# EAGLE design EEZ DIB AUX PS r3B5 (EAGLE 7.2.0)
Assembly variants: Farnell, TME

## Sheet 1 of 2: Power board tester
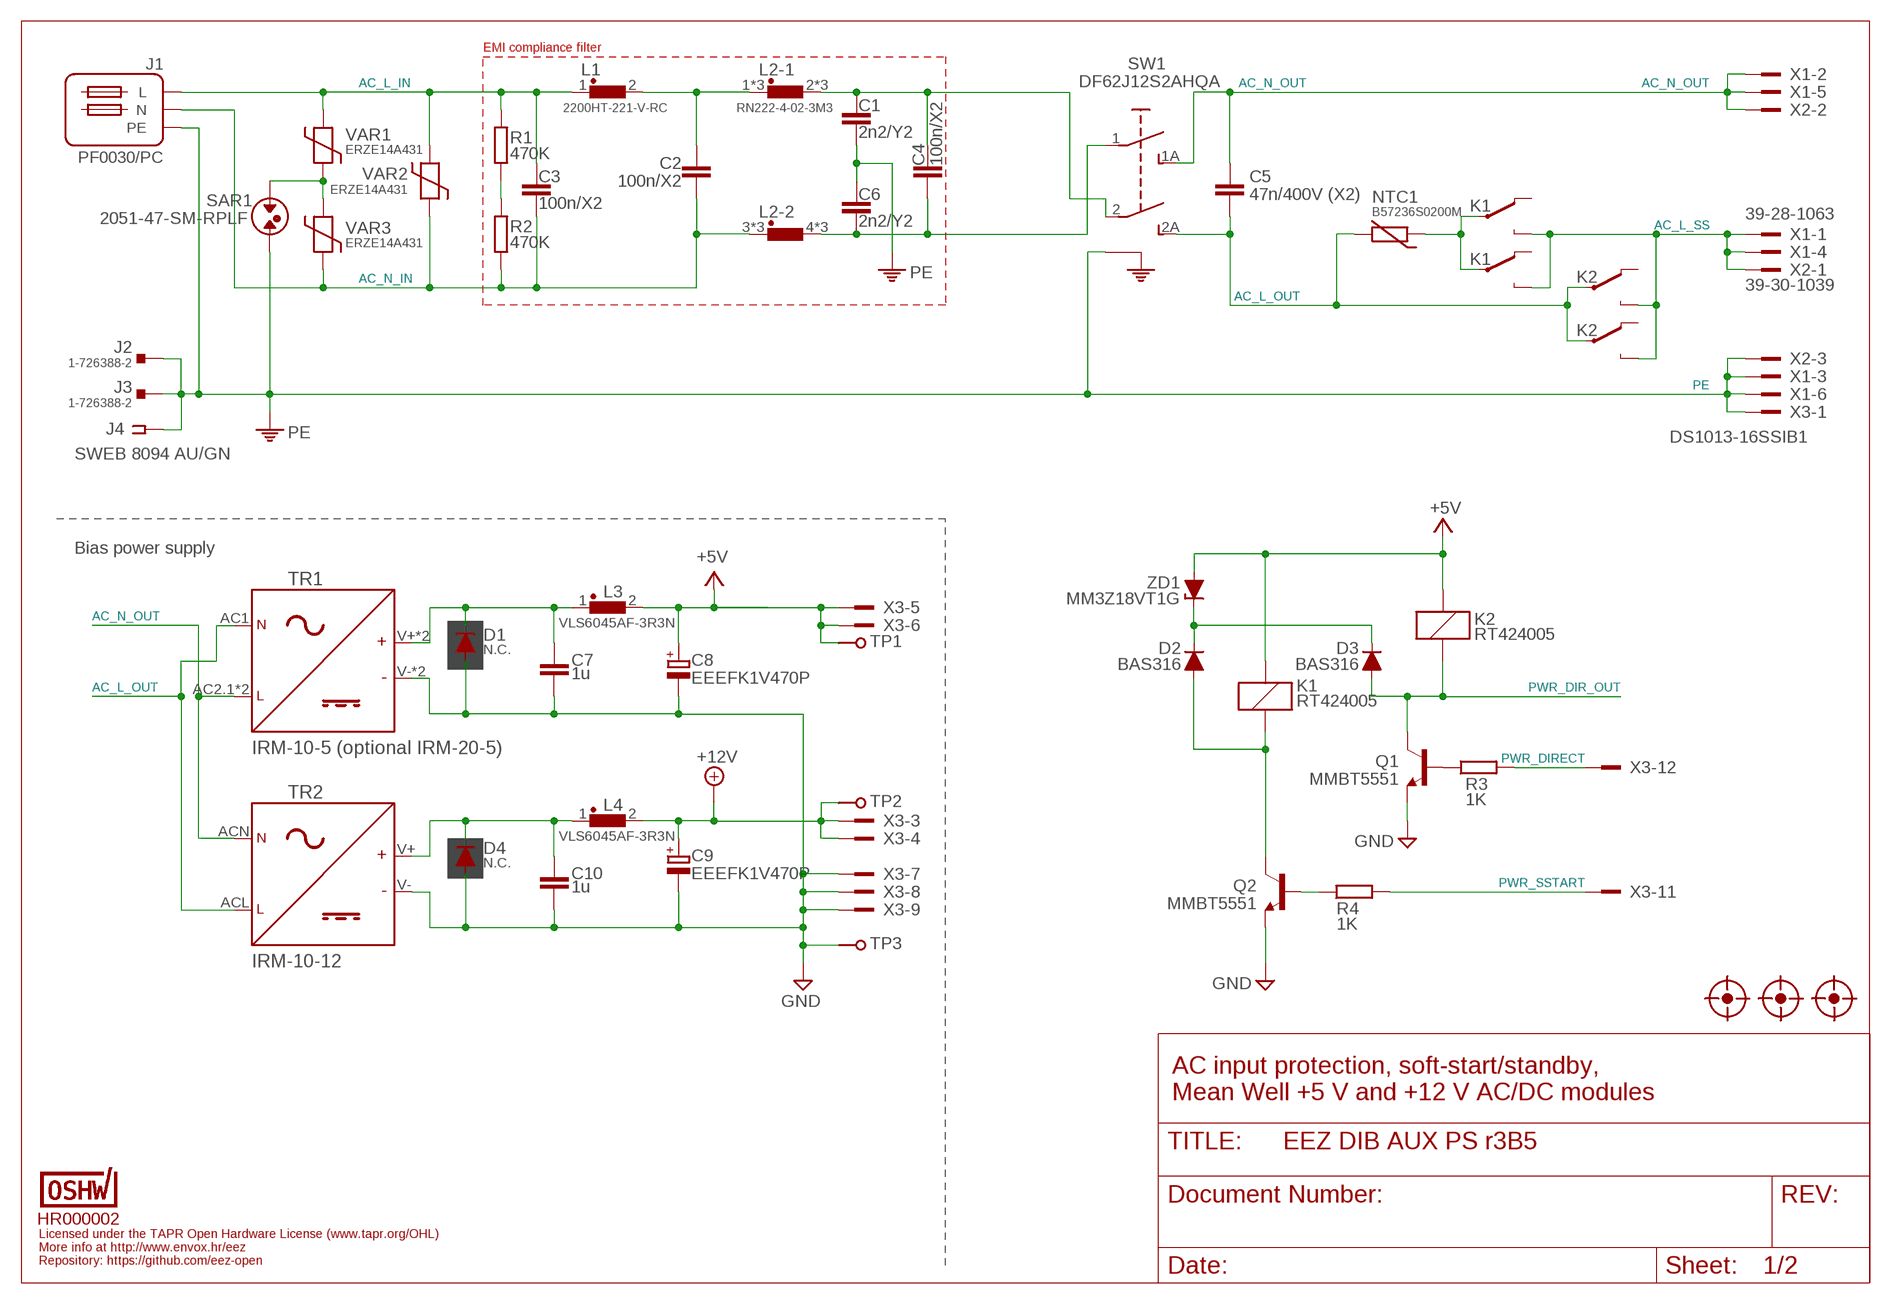
[diagram p0: schematic, sheet 1]

### Parts
C1  2n2/Y2  C-EU075-042X103  [C075-042X103]
C2  100n/X2  C-EU150-054X183  [C150-054X183]
C3  100n/X2  C-EU150-054X183  [C150-054X183]
C4  100n/X2  C-EU150-054X183  [C150-054X183]
C5  47n/400V (X2)  C-EU102-054X133  [C102-054X133]
C6  2n2/Y2  C-EU075-042X103  [C075-042X103]
C7  1u  C-EUC0805  [C0805]
C8  EEEFK1V470P  ECAPPANASONIC_H  [CAPAE660X610N]
C9  EEEFK1V470P  ECAPPANASONIC_H  [CAPAE660X610N]
C10  1u  C-EUC0805  [C0805]
D1  N.C.  DIODEDO214AA  [DO214AA]
D2  BAS316  DIODESOD323R  [SOD323-R]
D3  BAS316  DIODESOD323R  [SOD323-R]
D4  N.C.  DIODEDO214AA  [DO214AA]
FM1  FIDUCIAL  [FIDUCIAL]
FM2  FIDUCIAL  [FIDUCIAL]
FM3  FIDUCIAL  [FIDUCIAL]
J1  PF0030/PC  [PF0030/PC]
J2  1-726388-2  PCB_TAB4.8MM  [PCB_TAB-4.8MM]
J3  1-726388-2  PCB_TAB4.8MM  [PCB_TAB-4.8MM]
J4  SWEB 8094 AU/GN  BINDING_POSTCLIFF  [S16N-PC]
K1  RT424005  RELAY_RT314012-2  [RT-C/016A5_ROUND]
K2  RT424005  RELAY_RT314012-2  [RT-C/016A5_ROUND]
L1  2200HT-221-V-RC  BOURNS_2200  [BOURNS_2200]
L2  RN222-4-02-3M3  BOURNS_7100-COMBO  [BOURNS_7100_COMBO]
L3  VLS6045AF-3R3N  COILCRAFT_HPI0630  [COILCRAFT_HPI0630]
L4  VLS6045AF-3R3N  COILCRAFT_HPI0630  [COILCRAFT_HPI0630]
LABEL1  HR000002  OSHWA-CERT-SMALL  [CERT-SMALL-SILK]
NTC1  B57236S0200M  NTC11.5X6  [NTC_11.5X6_RM5]
Q1  MMBT5551  MMBT5551LT1-NPN-SOT23-BEC  [SOT23-BEC]
Q2  MMBT5551  MMBT5551LT1-NPN-SOT23-BEC  [SOT23-BEC]
R1  470K  R-EU_R1206  [R1206]
R2  470K  R-EU_R1206  [R1206]
R3  1K  R-EU_R0805  [R0805]
R4  1K  R-EU_R0805  [R0805]
SAR1  2051-47-SM-RPLF  SAR-SG  [SAR_4.5MM]
SW1  DF62J12S2AHQA  [DF62J12S2]
TP1  PCB_TEST_TABSHIELD  [PCB_SHIELD_TAB]
TP2  PCB_TEST_TABSHIELD  [PCB_SHIELD_TAB]
TP3  PCB_TEST_TABSHIELD  [PCB_SHIELD_TAB]
TR1  IRM-10-5 (optional IRM-20-5)  AC_DC_ADAPTERIRM10/20  [IRM-10/20_COMBO]
TR2  IRM-10-12  AC_DC_ADAPTERIRM10  [IRM-10]
VAR1  ERZE14A431  VARISTOR-16  [VARISTOR_16MM]
VAR2  ERZE14A431  VARISTOR-16  [VARISTOR_16MM]
VAR3  ERZE14A431  VARISTOR-16  [VARISTOR_16MM]
X1  39-28-1063  MINIFIT_5566-06A-CRE  [MINIFIT_5566-06A_CRE]
X2  39-30-1039  MINIFIT_39301039-CREEPAGE  [MINIFIT_39301039_CRE]
X3  DS1013-16SSIB1  IDC-16PIN  [IDC-16PIN]
ZD1  MM3Z18VT1G  ZENER-DIODESOD323R  [SOD323-R]

### Nets
+5V: C8.1(+) K1.A2(K:C1) K2.A1(K:C2) L3.2 TP1.1 X3.5 X3.6 ZD1.A ; also sheet 2
+12V: C9.1(+) L4.2 TP2.1 X3.3 X3.4 ; also sheet 2
AC_L_IN: C3.1 J1.L L1.1 R1.2 VAR1.2 VAR2.1
AC_L_OUT: C5.2 K2.11A(-1:P) K2.11B(-2:P) NTC1.1 SW1.2A(S1) TR1.AC1(AC/N) TR2.ACL(AC/L) ; also sheet 2
AC_L_RTC: C1.1 C4.2 L2.2 L2.2A L2.2B SW1.2(P1)
AC_L_SS: K1.14A(-1:O) K1.14B(-2:O) K2.14A(-1:O) K2.14B(-2:O) X1.1 X1.4 X2.1
AC_N_IN: C2.2 C3.2 J1.N L2.3 L2.3A L2.3B R2.1 VAR2.2 VAR3.1
AC_N_OUT: C5.1 SW1.1A(S) TR1.AC2.1(AC/L) TR1.AC2.2(AC/L) TR2.ACN(AC/N) X1.2 X1.5 X2.2 ; also sheet 2
AC_N_RTC: C4.1 C6.2 L2.4 L2.4A L2.4B SW1.1(P)
GND [gnd]: C7.2 C8.2(-) C9.2(-) C10.2 D1.A D4.A Q1.E Q2.E TP3.1 TR1.V-1(-) TR1.V-(-) TR2.V-(-) X3.7 X3.8 X3.9 ; also sheet 2
N$1: R1.1 R2.2
N$5: C2.1 L1.2 L2.1 L2.1A L2.1B
N$6: SAR1.1 VAR1.1 VAR3.2
N$7: K1.11A(-1:P) K1.11B(-2:P) NTC1.2
N$8: C10.1 D4.C L4.1 TR2.V+(+)
N$11: D2.C D3.C ZD1.C
N$12: Q2.B R4.1
N$15: C7.1 D1.C L3.1 TR1.V+1(+) TR1.V+(+)
N$16: D2.A K1.A1(K:C2) Q2.C
N$17: Q1.B R3.1
PE: C1.2 C6.1 J1.PE J2.1 J2.2 J3.1 J3.2 J4.1 J4.NC1 J4.NC2 J4.NC3 J4.NC4 SAR1.2 SW1.PE1(PE) SW1.PE2(PE) X1.3 X1.6 X2.3 X3.1
PWR_DIR_OUT: D3.A K2.A2(K:C1) Q1.C ; also sheet 2
PWR_DIRECT: R3.2 X3.12
PWR_SSTART: R4.2 X3.11
Unconnected: K1.12A(-1:S) K1.12B(-2:S) K2.12A(-1:S) K2.12B(-2:S) X3.10

### Notes on the sheet
- EMI compliance filter
- Bias power supply
- AC input protection, soft-start/standby,
  Mean Well +5 V and +12 V AC/DC modules
- Licensed under the TAPR Open Hardware License (www.tapr.org/OHL)
- More info at http://www.envox.hr/eez
- Repository: https://github.com/eez-open

## Sheet 2 of 2
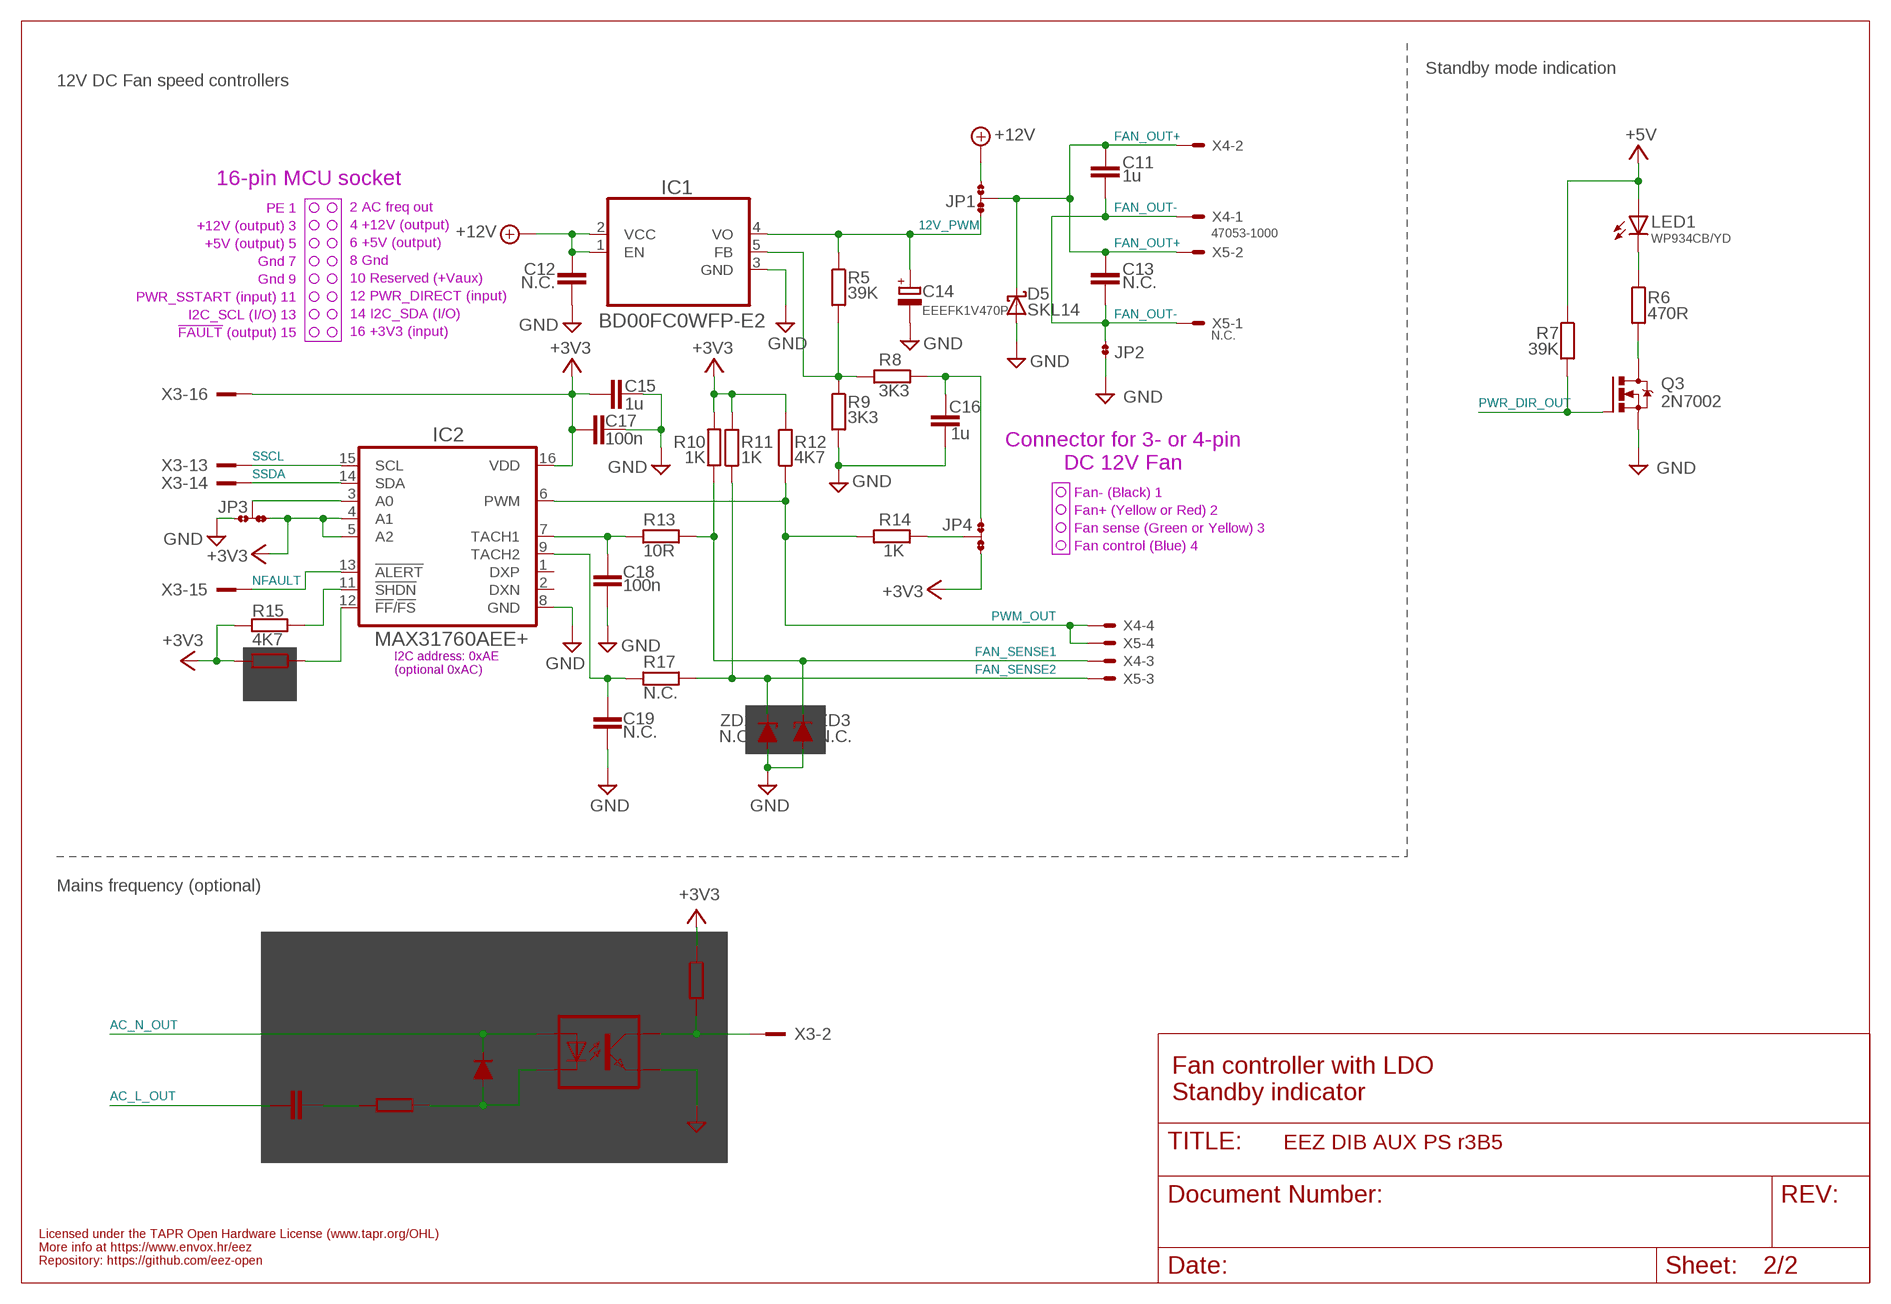
[diagram p1: schematic, sheet 2]

### Parts
C11  1u  C-EUC0805  [C0805]
C12  N.C.  C-EUC0805  [C0805]
C13  N.C.  C-EUC0805  [C0805]
C14  EEEFK1V470P  ECAPPANASONIC_H  [CAPAE660X610N]
C15  1u  C-EUC0805  [C0805]
C16  1u  C-EUC0805  [C0805]
C17  100n  C-EUC0603  [C0603]
C18  100n  C-EUC0603  [C0603]
C19  N.C.  C-EUC0603  [C0603]
C20  N.C.  C-EU102-054X133  [C102-054X133]
D5  SKL14  SCHOTTKYSOD123  [SOD123]
D6  N.C.  DIODESOD323R  [SOD323-R]
IC1  BD00FC0WFP-E2  BD00FC0W  [TO-252-5]
IC2  MAX31760AEE+  [DBQ16]
JP1  JP3-CUT-0805-ROTATED  [JP3-0805-CUT2]
JP2  JP2-NOCUT-0805  [JP2-0805-NOCUT]
JP3  JP3-CUT-0805-ROTATED  [JP3-0805-CUT2]
JP4  JP3-CUT-0805-ROTATED  [JP3-0805-CUT2]
LED1  WP934CB/YD  [WP934CB/YD]
OK1  N.C.  TLP291  [SO4]
Q3  2N7002  [SOT103P240X110-3N]
R5  39K  R-EU_R0805  [R0805]
R6  470R  R-EU_R0805  [R0805]
R7  39K  R-EU_R0805  [R0805]
R8  3K3  R-EU_R0805  [R0805]
R9  3K3  R-EU_R0805  [R0805]
R10  1K  R-EU_R0805  [R0805]
R11  1K  R-EU_R0805  [R0805]
R12  4K7  R-EU_R0805  [R0805]
R13  10R  R-EU_R0805  [R0805]
R14  1K  R-EU_R0805  [R0805]
R15  4K7  R-EU_R0805  [R0805]
R16  N.C.  R-EU_R0805  [R0805]
R17  N.C.  R-EU_R0805  [R0805]
R18  N.C.  R-EU_R0805  [R0805]
R19  N.C.  R-EU_R0805  [R0805]
X4  47053-1000  [47053-1000]
X5  N.C.  47053-1000  [47053-1000]
ZD2  N.C.  ZENER-DIODESOD123  [SOD123]
ZD3  N.C.  ZENER-DIODESOD123  [SOD123]

### Nets
12V_PWM: C14.1(+) IC1.4(VO) JP1.NC R5.1
+3V3: C15.2 C17.2 IC2.4(A1) IC2.5(A2) IC2.16(VDD) JP3.NC JP4.NO R10.2 R11.2 R12.2 R15.2 R16.2 R18.1 X3.16
+5V: LED1.A R7.1 ; also sheet 1
+12V: C12.1 IC1.1(EN) IC1.2(VCC) JP1.NO ; also sheet 1
AC_L_OUT: C20.1 ; also sheet 1
AC_N_OUT: D6.C OK1.1(A) ; also sheet 1
FAN_OUT+: C11.1 C13.1 D5.C JP1.COM X4.2 X5.2
FAN_OUT-: C11.2 C13.2 JP2.2 X4.1 X5.1
FAN_SENSE1: R10.1 R13.2 X4.3 ZD3.C
FAN_SENSE2: R11.1 R17.2 X5.3 ZD2.C
GND [gnd]: C12.2 C14.2(-) C15.1 C16.2 C17.1 C18.2 C19.2 D5.A IC1.3(GND) IC2.8(GND) JP2.1 JP3.NO OK1.3(EMIT) Q3.2(S) R9.2 ZD2.A ZD3.A ; also sheet 1
LDO_FB: IC1.5(FB) R5.2 R8.1 R9.1
N$2: C18.1 IC2.7(TACH1) R13.1
N$3: IC2.12(!FF!/!FS!) R16.1
N$4: JP4.COM R14.1
N$9: C16.1 JP4.NC R8.2
N$10: D6.A OK1.2(C) R19.2
N$13: Q3.3(D) R6.2
N$14: LED1.C R6.1
N$18: IC2.11(!SHDN) R15.1
N$19: OK1.4(COL) R18.2 X3.2
N$20: C20.2 R19.1
N$21: C19.1 IC2.9(TACH2) R17.1
N$23: IC2.3(A0) JP3.COM
NFAULT: IC2.13(!ALERT) X3.15
PWM_OUT: IC2.6(PWM) R12.1 R14.2 X4.4 X5.4
PWR_DIR_OUT: Q3.1(G) R7.2 ; also sheet 1
SSCL: IC2.15(SCL) X3.13
SSDA: IC2.14(SDA) X3.14
Unconnected: IC2.1(DXP) IC2.2(DXN)

### Notes on the sheet
- 12V DC Fan speed controllers | Standby mode indication
- 16-pin MCU socket
- PE 1
- 2 AC freq out
- +12V (output) 3
- 4 +12V (output)
- +5V (output) 5
- 6 +5V (output)
- Gnd 7
- 8 Gnd
- Gnd 9
- 10 Reserved (+Vaux)
- PWR_SSTART (input) 11
- 12 PWR_DIRECT (input)
- I2C_SCL (I/O) 13
- 14 I2C_SDA (I/O)
- !FAULT! (output) 15
- 16 +3V3 (input)
- Connector for 3- or 4-pin
  DC 12V Fan
- Fan- (Black) 1
- Fan+ (Yellow or Red) 2
- Fan sense (Green or Yellow) 3
- Fan control (Blue) 4
- I2C address: 0xAE
  (optional 0xAC)
- Mains frequency (optional)
- Fan controller with LDO
  Standby indicator
- Licensed under the TAPR Open Hardware License (www.tapr.org/OHL)
- More info at https://www.envox.hr/eez
- Repository: https://github.com/eez-open

## Library data of the parts
C1-C7 C10-C13 C15-C20 = rcl:C-EU: CAPACITOR, European symbol
C8 C9 C14 = EEZ_Lib1:ECAP
D1 D4 = MyLib6:DIODE
D2 D3 D6 = EEZ_Lib1:DIODE
D5 = EEZ_Lib1:SCHOTTKY
FM1-FM3 = EEZ_Lib1:FIDUCIAL: Fiducial mark for pick and place automation
IC1 = EEZ_DIB:BD00FC0W: Single-Output low saturation 1A LDO Regulator
IC2 = EEZ_DIB:MAX31760AEE+: Precision Fan-Speed Controller with Nonvolatile Lookup Table
J1 = EEZ_connectors:PF0030/PC: PC Flanged Mount Fused Inlet, twin fused 5 x 20 mm, 250 Vac, 10 A, PC spills
J2 J3 = EEZ_connectors:PCB_TAB: PCB quick-fit terminal
J4 = EEZ_Lib1:BINDING_POST: Various 4 mm binding posts
JP1 JP3 JP4 = EEZ_Lib1:JP3-CUT
JP2 = EEZ_Lib1:JP2-NOCUT
K1 K2 = EEZ_Lib1:RELAY_RT314012
L1 = EEZ_inductors_and_transformers:BOURNS_2200
L2 = EEZ_inductors_and_transformers:BOURNS_7100: Common Mode EMI Choke
L3 L4 = EEZ_inductors_and_transformers:COILCRAFT_HPI0630: High power inductor
LABEL1 = EEZ_Lib1:OSHWA-CERT
LED1 = EEZ_Lib1:WP934CB/YD: T-1 (3mm) Single-Level Circuit Board Indicator
NTC1 = EEZ_Lib1:NTC
OK1 = EEZ_Lib1:TLP291: Toshiba Photocopler GaAs IRED & Photo-transistor
Q1 Q2 = transistor:*-NPN-: NPN Transistror BF959 corrected 2008.03.06
Q3 = EEZ_Lib1:2N7002: N-CHANNEL ENHANCEMENT MODE FIELD EFFECT TRANSISTOR; MPN: 2N7002-7-F; OC_FARNELL: 1713823; OC_NEWARK: 25R5679; PACKAGE: SOT-23-3; SUPPLIER: DIODES INC.
R1-R19 = rcl:R-EU_: RESISTOR, European symbol
SAR1 = EEZ_Lib1:SAR: EPCOS surge arrester EF470X Farnell: 1886596
SW1 = EEZ_switches:DF62J12S2: Rocker switch SPST; Positions:2; OFF-ON; 16A/250VAC; 6A/48VDC
TP1-TP3 = EEZ_Lib1:PCB_TEST_TAB
TR1 TR2 = EEZ_Lib1:AC_DC_ADAPTER: MYRRA 47202 AC/DC PCB Mount Power Supply, Switch Mode, Fixed, 1 Output
VAR1-VAR3 = EEZ_Lib1:VARISTOR: EPCOS - B72220S0251K101 - VARISTOR, 140J, 250VAC Farnell: 1004357
X1 = EEZ_connectors:MINIFIT_5566-06A: Molex Socket; wire-board; male; Mini-Fit Jr; 4.2mm; PIN:6; THT; 9A; tinned
X2 = EEZ_connectors:MINIFIT_39301039: MOLEX socket; wire-board; male; Mini-Fit Jr; 4.2mm; PIN:3; THT; PCB snap
X3 = EEZ_connectors:IDC-16PIN: 16-pin IDC socket
X4 X5 = EEZ_connectors:47053-1000: KK 254 Vertical Header, with Friction Lock, 4 Circuits, PC Tail Length: 3.50mm
ZD1-ZD3 = EEZ_Lib1:ZENER-DIODE

## Net classes
0 default: width 0.152 mm, drill 0.3 mm, clearance 0.152 mm
1 diff: width 0.254 mm, drill 0.3 mm, clearance 0.254 mm
2 gnd: width 0.152 mm, drill 0.3 mm, clearance 0.152 mm

## Board
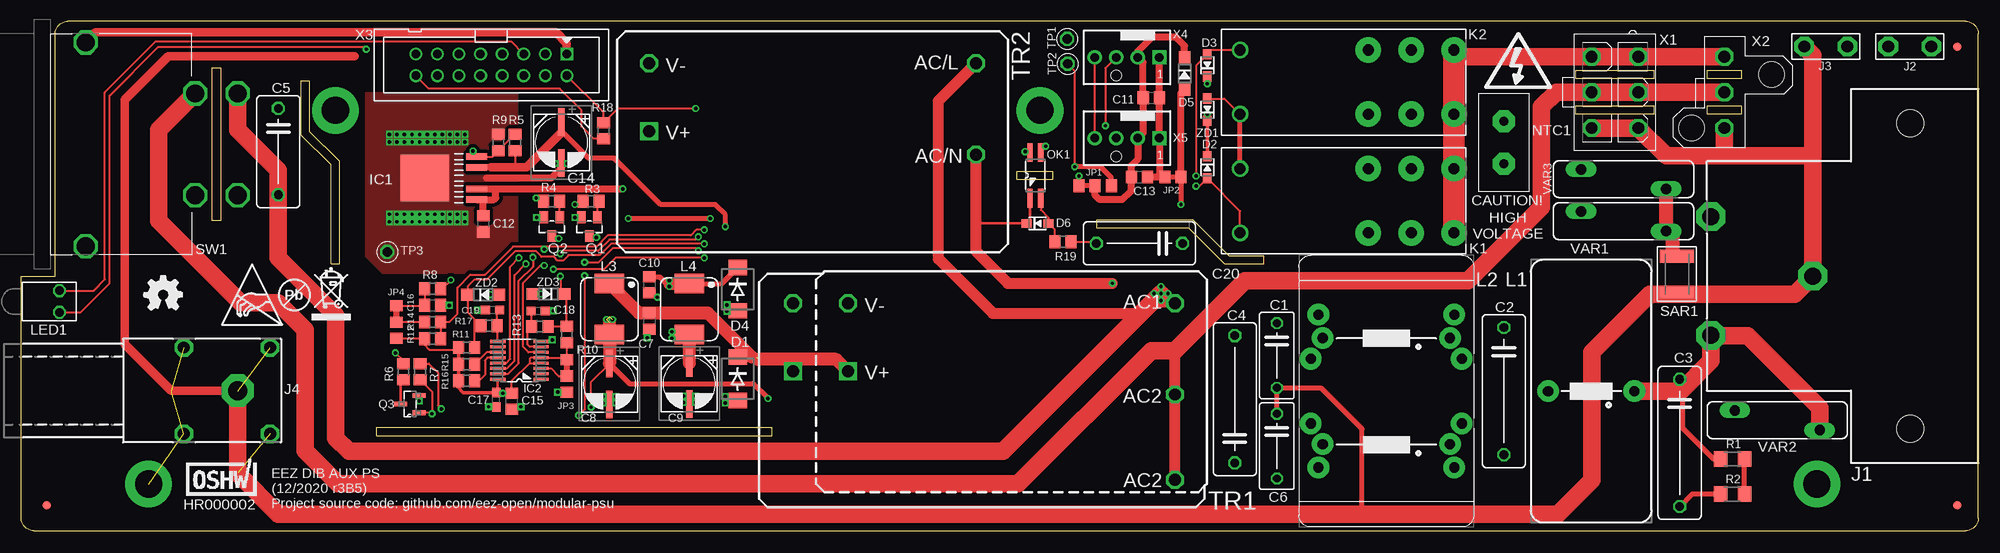
[diagram p2: board, top side]
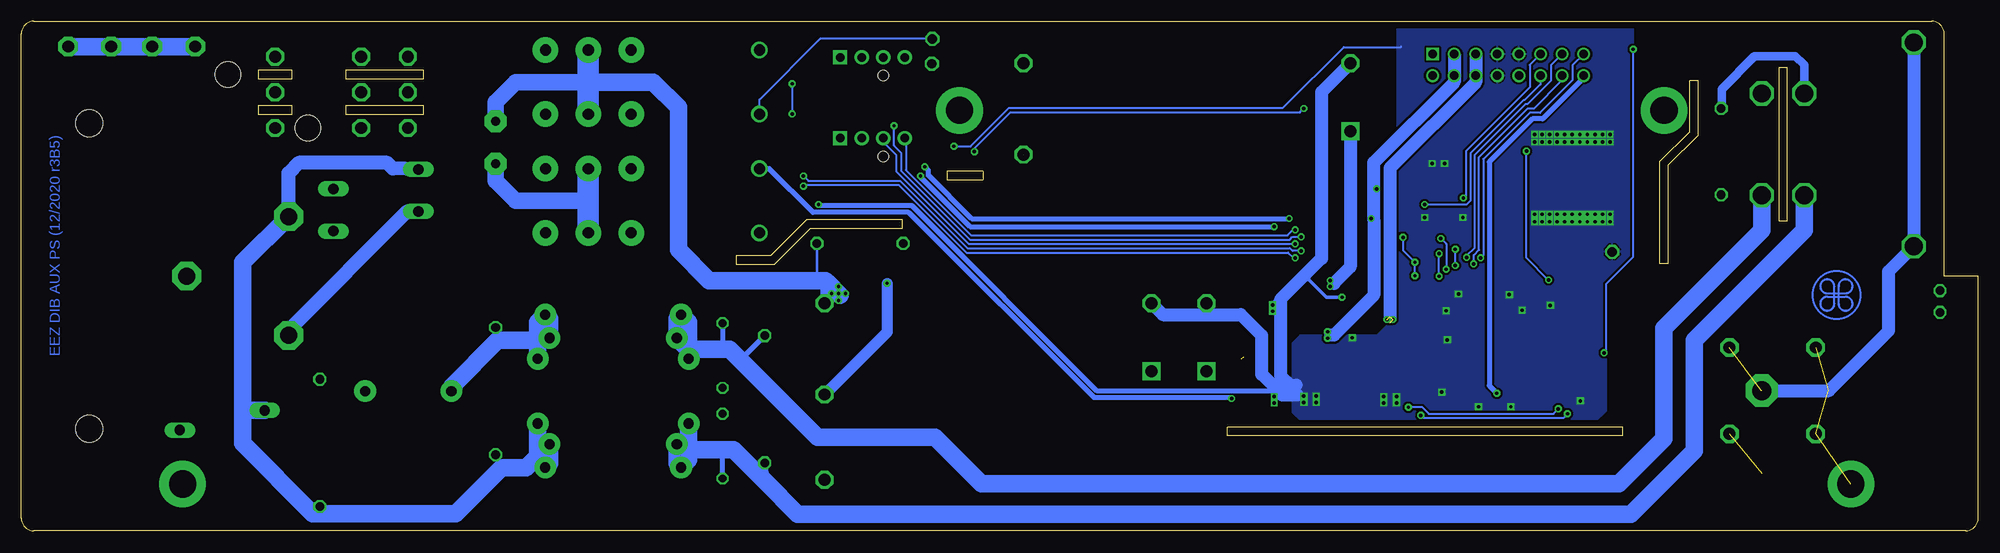
[diagram p3: board, bottom side, seen from below]

Size 230.5 x 60 mm. Coordinates in mm from the lower left corner, seen from the top.
Outline: 1.5,0 229,0 arc90 230.5,1.5 230.5,58.5 arc90 229,60 5.5,60 arc90 4,58.5 4,30 0,30 0,1.5 arc90 1.5,0
Outline: 33,46.6 33,53 34,53 34,47 37.5,43.5 37.5,31.42 36.5,31.42 36.5,43.1 33,46.6
Outline: 41.85,11.18 88.46,11.18 88.46,12.19 41.85,12.19 41.85,11.18
Outline: 126.68,36.64 137.99,36.64 142.24,32.38 146.3,32.38 146.3,31.37 141.8,31.37 137.54,35.62 126.68,35.62 126.68,36.64
Outline: 117.22,42.35 121.47,42.35 121.47,41.34 117.22,41.34 117.22,42.35
Copper layers (1*16): Top 0.035mm / dielectric 1.5mm / Bottom 0.035mm
Design rules "default *": minimum track width 6mil, minimum drill 0.3mm, track to track 4mil, track to pad 4mil, pad to pad 4mil, via to via 4mil, smd to smd 4mil, copper to edge 30mil, drill to drill 8mil, minimum pad ring 4mil, minimum via ring 8mil, stop-mask expansion 2.5mil, vias tented up to drill 0.6mm, thermal gap 8mil
vRestrict: area 167.3,39.9 to 169.9,41.1; area 167.4,53.8 to 170.1,55.1; area 167.4,50.5 to 170.1,51.8

### Footprints (pad centres in the part's own frame; a part is rotated, then mirrored left to right if it is on the bottom)
C075-042X103 = drill 0.914 octagon: 1 -3.81,0; 2 3.81,0
C150-054X183 = drill 1.016 octagon: 1 -7.493,0; 2 7.493,0
C102-054X133 = drill 1.016 octagon: 1 -5.08,0; 2 5.08,0
C0805 = smd 1.3 x 1.5: 1 -0.95,0; 2 0.95,0
CAPAE660X610N = smd 3.251 x 0.762: 1 -2.413,0; 2 2.413,0
C0603 = smd 1.1 x 1: 1 -0.85,0; 2 0.85,0
DO214AA = smd 1.8 x 2.2: A 2.55,0; C -2.55,0
SOD323-R = smd 1.2 x 1: A 1.3,0; C -1.3,0
SOD123 = smd 1.4 x 1.4: A 1.9,0; C -1.9,0
FIDUCIAL = smd 1.016 x 1.016: T 0,0
TO-252-5 = smd 0.762 x 2.489: 1 -2.54,-6.413; 2 -1.27,-6.413; 4 1.27,-6.413; 5 2.54,-6.413 | smd 5.5 x 5.7: 3 0,-0.32
DBQ16 = smd 1.803 x 0.356: 1 -2.553,2.223; 2 -2.553,1.587; 3 -2.553,0.953; 4 -2.553,0.318; 5 -2.553,-0.318; 6 -2.553,-0.953; 7 -2.553,-1.587; 8 -2.553,-2.223; 9 2.553,-2.223; 10 2.553,-1.587; 11 2.553,-0.953; 12 2.553,-0.318; 13 2.553,0.318; 14 2.553,0.953; 15 2.553,1.587; 16 2.553,2.223
PF0030/PC = drill 2 pad 3.4 octagon: L -7,31.5; N 7,31.5; PE 0,19.5 | hole 3.2: 18,8; -18,8
PCB_TAB-4.8MM = drill 1.4 pad 2.3 octagon: 1 -2.54,0; 2 2.54,0
S16N-PC = drill 2.2 pad 3.81 octagon: 1 0,0 | drill 1.4 pad 2.184 octagon: NC1 -3.8,5.08; NC2 -3.8,-5.08; NC3 6.36,5.08; NC4 6.36,-5.08
JP3-0805-CUT2 = smd 1.3 x 1.5: COM 0,0; NC 1.9,0; NO -1.9,0
JP2-0805-NOCUT = smd 1.3 x 1.5: 1 -0.95,0; 2 0.95,0
RT-C/016A5_ROUND = drill 1.3 pad 3: 11A 8.83,3.78; 11B 8.83,-3.78; 12A 3.79,3.78; 12B 3.79,-3.78; 14A 13.87,3.78; 14B 13.87,-3.78 | drill 1.3: A1 -11.33,-3.78; A2 -11.33,3.78
BOURNS_2200 = drill 1.2 pad 2.54: 1 -5.08,0; 2 5.08,0
BOURNS_7100_COMBO = drill 1.2 pad 2.54: 1 -8.89,-3.81; 1A -7.5,-6.25; 1B -8,-9; 2 8.89,-3.81; 2A 7.5,-6.25; 2B 8,-9; 3 -8.89,3.81; 3A -7.5,6.25; 3B -8,9; 4 8.89,3.81; 4A 7.5,6.25; 4B 8,9
COILCRAFT_HPI0630 = smd 2.3 x 3.5: 1 -3,0; 2 3,0
WP934CB/YD = drill 1 octagon: A 0,1.27; C 0,-1.27
NTC_11.5X6_RM5 = drill 1.1 pad 2.54 octagon: 1 -2.5,0; 2 2.5,0
SO4 = smd 0.6 x 2.2: 1 -0.635,-2.7; 2 0.635,-2.7; 3 0.635,2.7; 4 -0.635,2.7
SOT23-BEC = smd 1 x 1.4: B -0.95,-1.1; C 0,1.1; E 0.95,-1.1
SOT103P240X110-3N = smd 1.524 x 0.559: 1 -1.079,1.016; 2 -1.079,-1.016; 3 1.079,0
R1206 = smd 1.6 x 1.803: 1 -1.422,0; 2 1.422,0
R0805 = smd 1.3 x 1.5: 1 -0.95,0; 2 0.95,0
SAR_4.5MM = smd 1.5 x 4: 1 -2.1,0; 2 2.1,0
DF62J12S2 = drill 2.1 octagon: 1 17,-6; 1A 17,6; 2 22,-6; 2A 22,6; PE1 4.1,-12; PE2 4.1,12
PCB_SHIELD_TAB = drill 1.1 octagon: 1 0,0
IRM-10/20_COMBO = drill 1.4 octagon: AC1 3.75,3.75; AC2.1 3.75,14.5; AC2.2 3.75,24.55; V- 42.25,3.75; V-1 48.75,3.75 | drill 1.4 square: V+ 42.25,11.75; V+1 48.75,11.75
IRM-10 = drill 1.4 octagon: ACL 3.75,3.75; ACN 3.75,14.5; V- 42.25,3.75 | drill 1.4 square: V+ 42.25,11.75
VARISTOR_16MM = drill 1.2 long: 1 5,-1.15; 2 -5,1.15
MINIFIT_5566-06A_CRE = drill 1.4 octagon: 1 -4.2,2.75; 2 0,2.75; 3 4.2,2.75; 4 -4.2,-2.75; 5 0,-2.75; 6 4.2,-2.75
MINIFIT_39301039_CRE = drill 1.4 octagon: 1 0,4.2; 2 0,0; 3 0,-4.2 | hole 3: 5.55,2.1; -3.85,-4.2
IDC-16PIN = drill 1 pad 1.422 square: 1 -8.89,-1.27 | drill 1 pad 1.422: 2 -8.89,1.27; 3 -6.35,-1.27; 4 -6.35,1.27; 5 -3.81,-1.27; 6 -3.81,1.27; 7 -1.27,-1.27; 8 -1.27,1.27; 9 1.27,-1.27; 10 1.27,1.27; 11 3.81,-1.27; 12 3.81,1.27; 13 6.35,-1.27; 14 6.35,1.27; 15 8.89,-1.27; 16 8.89,1.27
47053-1000 = drill 1 pad 1.676 square: 1 3.81,0 | drill 1 pad 1.676: 2 1.27,0; 3 -1.27,0; 4 -3.81,0 | hole 1.25: -1.27,-2.16

### Placement (x,y rotation side)
C1  147.89,20.64 270 top
C2  174.62,16.45 270 top
C3  195.33,10.35 270 top
C4  142.94,15.49 90 top
C5  30.28,44.65 270 top
C6  147.89,9.97 270 top
C7  73.98,24.7 270 top
C8  69.28,17.27 270 top
C9  78.68,17.34 270 top
C10  73.98,28.96 270 top
C11  133.1,50.99 0 top
C12  54.42,36.13 270 top
C13  131.7,41.66 0 top
C14  63.63,45.72 270 top
C15  57.78,15.24 90 top
C16  48.45,26.54 0 top
C17  55.94,15.43 90 top
C18  60.9,25.91 0 top
C19  55.5,25.97 180 top
C20  131.7,33.85 180 top
D1  84.39,17.91 270 top
D2  139.7,42.8 270 top
D3  139.7,54.8 90 top
D4  84.39,28.45 270 top
D5  137.03,53.85 270 top
D6  119.7,36.2 0 top
EEZ_SIGNATURE  SIGNATURESMALL  [SIGNATURE_5MM]  16.71,27.76 180 top
FM1  228,3 0 top
FM2  3,3 0 top
FM3  228,57 0 top
IC1  47.24,41.53 90 top
IC2  58.67,20.07 180 top
J1  230.5,30 90 top
J2  222.44,57.02 180 top
J3  212.53,57.02 0 top
J4  25.5,16.5 180 top
JP1  126.49,40.64 180 top
JP2  135.64,41.66 180 top
JP3  64.26,18.22 90 top
JP4  44.2,24.57 90 top
K1  154.88,38.86 0 top
K2  154.88,52.83 0 top
L1  184.91,16.45 180 top
L2  160.78,16.45 180 top
L3  69.28,26.1 270 top
L4  78.68,26.1 270 top
LABEL1  23.56,4.13 0 top
LED1  4.5,27 0 top
NTC1  174.62,45.72 270 top
OK1  119.44,41.85 0 top
Q1  66.93,35.81 180 top
Q2  62.48,35.81 180 top
Q3  45.78,14.92 180 top
R1  201.55,8.45 180 top
R2  201.55,4.32 0 top
R3  67.12,38.8 180 top
R4  62.48,38.8 180 top
R5  58.17,45.72 90 top
R6  45.02,18.73 270 top
R7  46.99,18.73 270 top
R8  48.45,28.51 180 top
R9  56.2,45.72 90 top
R10  64.26,23.11 270 top
R11  52.45,21.59 180 top
R12  48.45,22.61 180 top
R13  61.09,24.07 0 top
R14  48.45,24.57 0 top
R15  52.45,19.62 180 top
R16  52.45,17.65 180 top
R17  55.12,24.13 180 top
R18  68.58,47.12 90 top
R19  122.68,34.04 180 top
SAR1  195.01,30.23 270 top
SW1  3.5,45.5 0 top
TP1  123.19,57.91 0 top
TP2  123.25,54.99 0 top
TP3  43.12,32.83 180 top
TR1  139.64,30.54 180 top
TR2  116.2,58.8 180 top
U$2  [PB_SMALL]  32.16,27.78 180 top
U$3  [RECYCLE_BIN1/8]  34.2,24.8 0 top
U$4  [ESD_SYMBOL]  23.62,24.27 0 top
VAR1  188.72,36.45 0 top
VAR2  206.82,13.02 0 top
VAR3  188.72,41.4 180 top
X1  187.71,51.63 270 top
X2  200.6,51.63 0 top
X3  55.37,54.86 180 top
X4  130.24,55.75 0 top
X5  130.24,46.23 0 top
ZD1  139.7,49.59 90 top
ZD2  54.42,27.81 0 top
ZD3  62.1,27.88 180 top

### Tracks (layer width: path | path; a pad name or v marks a point on that pad's centre or on a via)
12V_PWM  (via drill 0.4)
  Top 0.254: 58.17,42.74 58.23,42.8 | R5.1 58.17,42.86 58.1,42.8
  Top 0.406: 63.5,46.8 63.5,48.01 C14.1
  Top 0.61: JP1.NC v124.59,41.78 | v82.93,35.81 82.93,37.21 81.72,38.42 75.31,38.42 69.85,43.88 66.8,43.88 63.88,46.8 63.5,46.8
  Top 0.711: 55.37,42.8 IC1.4
  Top 1.016: 55.37,42.8 58.1,42.8 58.23,42.8 59.5,42.8 63.5,46.8
  Bottom 0.61: v82.93,35.81 118.75,35.81 124.59,41.66 v124.59,41.78
+3V3  (via drill 0.4)
  Top 0.254: 55.77,17.84 IC2.16 55.69,17.84 55.44,17.78 | C15.2 57.78,17.65 59.88,19.75 | 59.88,19.75 IC2.4 | 59.88,19.75 59.88,20.26 60.01,20.38 IC2.5 64,20.38 JP3.NC R10.2 | R11.2 51.25,21.34 48.07,21.34 47.5,21.91 R12.2 47.43,22.67 JP4.NO | R18.1 67.43,46.17 65.98,47.62 65.98,49.53 63.44,52.07 48.01,52.07 X3.16
  Top 0.305: 56.07,17.79 IC2.16 56.12,16.28 C17.2
  Top 0.406: R11.2 R15.2 R16.2 51.44,17.59 51.44,16.89 52.05,16.28 C17.2
  Top 0.61: 57.91,15.94 C15.2 v56.71,16.19 56.71,16.28 56.12,16.28
  Bottom 0.61: v56.71,16.19 57.59,17.08 57.59,43.43 52.51,48.51 51.31,48.51 46.48,53.34 X3.16
+5V  (via drill 0.4)  (3 unrouted)
  Top 0.254: LED1.A 8.52,28.27 9.84,29.59 9.84,51.63 15.85,57.63 57.68,57.63 X3.5 | R7.1 48.01,19.68 49.09,18.61 49.09,14.73 v49.47,14.35 | ZD1.A 141.71,50.89 K2.A1 | v67.12,14.54 67.12,17.53 C8.1
  Top 0.406: C8.1 69.28,19.3
  Top 0.61: 69.69,19.68 C8.1 71.63,17.34 86.19,17.34 v87.95,15.58 | K1.A2 K2.A1
  Top 1.524: C8.1 L3.2 69.29,24.5
  Bottom 0.254: v49.47,14.35 50.04,13.78 64.71,13.78 65.47,14.54 v67.12,14.54 | TP1.1 136.4,57.91 143.55,50.76 K2.A1
  Bottom 0.61: K1.A2 142.4,42.64 137.26,37.5 125.98,37.5 104.18,15.7 88.06,15.7 v87.95,15.58
  Bottom 1.524: X3.5 X3.6 59.18,52.83 69.28,42.74 69.28,25.21
  other vias: 68.95,24.88 69.64,24.88
+12V  (via drill 0.4)
  Top 0.254: TP2.1 124.08,54.17 v124.08,42.86 | L4.2 76.98,23.1 | 76.98,23.1 v76.64,23.43 | 76.98,23.1 76.64,22.77 v76.64,22.67
  Top 0.61: C9.1 78.68,19.05 | v81.15,36.77 v71.5,36.77 | v124.08,42.86 127.13,42.86 128.39,41.6 JP1.NO
  Top 0.813: IC1.2 55.75,40.26 | 55.75,40.26 v70.87,40.26 | IC1.1 54.36,38.99 | 54.36,38.99 55.69,38.99 55.88,39.18 55.88,40.13 55.75,40.26 | C12.1 54.42,38.92 54.36,38.99
  Top 1.524: L4.2 C9.1
  Bottom 0.254: 76.26,23.05 v76.64,22.67
  Bottom 0.61: v81.15,36.77 118.56,36.77 123.7,41.91 123.7,42.48 v124.08,42.86 | v71.5,36.77 71.31,36.77 71.18,36.64
  Bottom 0.813: v70.87,40.26 71.12,40.26 71.18,40.32
  Bottom 1.524: X3.3 X3.4 61.72,52.83 71.18,43.37 71.18,40.32 71.18,36.64 71.18,27.75 75.88,23.05 76.26,23.05
AC_L_IN
  Top 0.508: C3.1 195.33,16.57 195.45,16.45
  Top 0.61: R1.2 199.33,8.45 195.71,12.06 195.71,16.19 195.45,16.45
  Top 2.032: L1.1 195.45,16.45 199,19.99 J1.L 199.01,22.99 203.33,22.99 211.82,14.49 VAR2.1
  Bottom 1.676: J1.L 199,23.63 185.03,37.6 VAR1.2
AC_L_OUT  (via drill 0.4)
  Top 0.254: 108.08,47.5 108.01,47.43 | 108.2,39.81 108.01,39.81
  Top 1.016: TR1.AC1 133.92,26.79
  Top 1.27: TR2.ACL 108.01,50.61 108.01,47.43 108.01,39.81 108.01,32 114.43,25.59 131.89,25.59
  Top 2.032: SW1.2A 25.5,47.21 30.28,42.43 C5.2 30.28,32.14 37.02,25.4 37.02,10.92 38.6,9.34 115.64,9.34 131.89,25.59 134.21,27.91
  Bottom 0.254: 134.05,27.75 v134.24,27.94
  Bottom 0.305: C20.1 136.78,29.84 137.16,29.46
  Bottom 1.016: TR1.AC1 135.89,28.77 135.48,29.18
  Bottom 1.93: NTC1.1 174.62,50.48 172.28,52.83 164.21,52.83
  Bottom 2.032: 164.21,52.83 163.71,52.83 156.08,52.83 153.1,49.85 153.1,33.08 149.48,29.46 137.16,29.46 135.76,29.46 135.48,29.18 134.05,27.75
  Bottom 2.54: K2.11A 163.71,52.83 K2.11B
  other vias: 134.24,28.77 135.06,27.94 134.24,27.11 133.41,27.94
  pour Top (no thermals): 132.19,27.15 134.09,29.04 134.37,29.04 135.34,28.07 135.34,27.79 133.45,25.9
AC_L_RTC
  Bottom 0.61: C1.1 147.89,21.56 148.08,21.37 | 145.67,19.94 145.67,20.26 C4.2
  Bottom 2.032: SW1.2 25.5,35.4 37.02,23.88 37.02,10.86 42.35,5.52 117.41,5.52 122.87,10.99 136.72,10.99 145.67,19.94 147.1,21.37 148.08,21.37 151.95,21.37 L2.2A 153.28,24.95 L2.2B 151.89,24.56 L2.2
AC_L_SS
  Top 2.032: X2.1 X1.1 X1.4 169.53,55.83 K2.14A
  Top 2.54: K2.14A K2.14B K1.14A K1.14B
AC_N_IN
  Top 0.61: R2.1 196.79,4.32 C3.2
  Bottom 0.203: C3.2 195.33,2.22 195.52,2.03
  Bottom 0.61: 173.93,7.43 174.18,7.68 C2.2
  Bottom 1.676: VAR3.1 186.75,42.67 187.39,43.31 197.8,43.31 199,42.11 J1.N
  Bottom 2.032: L2.3 169.67,8.34 169.46,8.13 | 169.46,8.13 L2.3B 168.28,7.95 L2.3A 171.05,7.43 173.93,7.43 179.32,2.03 195.52,2.03 196.15,2.03 204.41,10.29 204.41,14.03 | 169.46,8.95 169.46,8.13 | J1.N 204.41,31.59 204.41,14.03 | VAR2.2 204.27,14.17 204.41,14.03
AC_N_OUT  (via drill 0.4)  (1 unrouted)
  Top 0.305: OK1.1 118.81,36.61 D6.C 112.58,36.2 112.46,36.32
  Top 1.27: TR2.ACN 112.46,36.32 112.46,32.89 116.2,29.15 v128.52,29.15 | 135.89,21.21 TR1.AC2.1 TR1.AC2.2
  Top 2.032: X2.2 X1.2 X1.5 180.78,51.63 179.07,49.91 179.07,38.12 170.41,29.46 144.15,29.46 135.89,21.21 133.09,21.21 117.41,5.52 37.34,5.52 33.47,9.4 33.47,23.69 30.28,26.87 25.84,26.87 16.19,36.51 16.19,47.19 SW1.1A
  Bottom 1.016: SW1.1A 20.5,54.85 21.53,55.88 26.35,55.88 30.23,52.01 30.23,49.78 C5.1
  Bottom 1.27: v128.52,29.15 128.52,23.41 TR1.AC2.1
AC_N_RTC
  Bottom 0.254: C4.1 142.57,8
  Bottom 0.61: C6.2 147.89,9.4 148.02,9.53 | C4.1 142.69,5.81 142.91,5.81
  Bottom 2.032: SW1.1 20.5,35.38 33.47,22.42 33.47,9.4 40.89,1.97 139.06,1.97 142.91,5.81 146.62,9.53 148.02,9.53 152.61,9.53 L2.4A 153.28,7.95 L2.4B 152.41,7.82 | L2.4 151.89,8.34 152.41,7.82 | 152.4,7.81 152.41,7.82
FAN_OUT+
  Top 0.813: D5.C 137.03,57.09 136.02,58.1 133.16,58.1 131.51,56.45 X4.2 132.15,55.12 C11.1 132.15,46.87 X5.2 131.51,43.75 130.75,42.99 C13.1 130.75,40.07 129.67,38.99 127,38.99 126.49,39.5 JP1.COM
FAN_OUT-
  Top 0.813: C13.2 134.18,41.66 | X4.1 C11.2 X5.1 134.05,41.78 134.18,41.66 | JP2.2 134.18,41.66
FAN_SENSE1  (via drill 0.4)
  Top 0.254: 64.52,27.82 ZD3.C | R13.2 R10.1 64.26,27.82 ZD3.C | 64.33,28.2 ZD3.C | v79.76,34.61 79.44,34.29 69.28,34.29 67.94,32.96 63.82,32.96 v63.5,32.64 | v63.5,29.97 63.5,28.38 ZD3.C | X4.3 127.7,54.48 v127.7,47.69
  Bottom 0.254: v79.76,34.61 80.77,34.61 81.09,34.29 118.77,34.29 126.87,42.39 126.87,44.51 127.7,45.34 v127.7,47.69 | v63.5,29.97 v63.5,32.64
FAN_SENSE2  (via drill 0.4)
  Top 0.254: 52.64,27.69 52.64,25.66 53.4,24.9 53.4,24.19 | 52.64,27.69 ZD2.C | R11.1 53.4,24.19 | R17.2 53.47,24.13 53.4,24.19 | 52.64,27.69 52.64,28.83 53.4,29.59 54.86,29.59 58.23,32.96 60.58,32.96 61.28,32.26 62.74,32.26 63.18,31.81 63.82,31.81 64.45,32.45 68.14,32.45 69.47,33.78 v80.45,33.78
  Bottom 0.254: v80.45,33.78 118.91,33.78 127.44,42.32 127.44,44.26 128.97,45.78 X5.3
GND  (via drill 0.4)
  Top 0.254: ZD3.A v61.21,27.88 | C18.2 v62.67,25.91 | ZD2.A v55.24,27.81 | IC2.8 62.36,22.29 v62.55,22.48 | C9.2 78.11,14.99 v77.98,15.11 | v68.52,15.05 69.09,15.05 C8.2 | v50.42,26.54 C16.2 | OK1.3 120.08,45.28 v120.65,45.28 | C7.2 73.72,23.5 v73.72,22.73 | C10.2 v74.93,27.5 | Q2.E 60.73,36.91 v60.71,36.89 | Q1.E 65.23,36.91 v65.22,36.89
  Top 0.305: v53.72,25.97 C19.2 | Q3.2 v46.86,15.3 | v63.18,16.32 JP3.NO | v58.86,14.61 C15.1
  Top 0.61: C17.1 v55.05,14.61 | JP2.1 v136.59,38.42 | D1.A 83.24,15.36 v82.93,15.05 | D4.A 83.17,25.9 v83.12,25.84
  Top 0.813: 54.8,41.53 62.42,41.53 63.63,42.74 C14.2 | JP2.1 136.59,49.34 136.59,51.5 D5.A
  Bottom 0.254: 77.66,48.9 77.34,48.58 | v120.65,45.28 118.68,45.28 114.17,49.78 81.92,49.78 74.74,56.96 68.01,56.96 67.94,57.02
  Bottom 0.406: v74.93,27.5 76.77,27.5 79.34,30.07
  Bottom 0.61: v136.59,38.42 136.49,38.32 125.64,38.32 103.83,16.51 81.99,16.51 81.48,16 | 81.98,16 82.74,16 v82.93,15.81 v82.93,15.05 | 82.17,27.24 82.49,27.24 v83.12,26.61 v83.12,25.84
  Bottom 0.813: 80.96,15.75 80.71,16
  Bottom 1.524: TR2.V- 77.34,51.66 77.34,48.58 77.34,32.07 79.34,30.07 82.17,27.24 82.17,18.22 81.09,17.14 80.33,17.14 | 80.2,16 80.71,16 81.48,16 81.98,16 84.39,18.41 84.39,22.99 86.87,25.46 90.93,25.46 | 90.93,25.46 96.06,25.46 TR1.V- | TR1.V-1 90.89,25.51 90.93,25.46
  other vias: 47.82,37.27 46.93,37.27 46.04,37.27 45.15,37.27 44.26,37.27 43.37,37.27 48.7,37.27 49.59,37.27 50.48,37.27 51.37,37.27 52.26,37.27 43.37,45.78 44.26,45.78 45.15,45.78 46.04,45.78 46.93,45.78 47.82,45.78 48.7,45.78 49.59,45.78 50.48,45.78 51.37,45.78 52.26,45.78 43.37,46.67 44.26,46.67 45.15,46.67 46.04,46.67 46.93,46.67 47.82,46.67 48.7,46.67 49.59,46.67 50.48,46.67 51.37,46.67 52.26,46.67 43.37,36.39 44.26,36.39 45.15,36.39 46.04,36.39 46.93,36.39 47.82,36.39 48.7,36.39 49.59,36.39 50.48,36.39 51.37,36.39 52.26,36.39 77.98,15.88 79.44,15.88 79.44,15.11 70.04,15.81 70.04,15.05 68.52,15.81 64.33,43.24 62.87,43.24
  pour Bottom (isolate 0.254): 79.63,12.83 45.15,12.83 43.81,14.16 43.81,29.08 40.64,32.26 40.64,60.64 68.45,60.64 68.45,25.34 70.8,22.99 79.88,22.99 80.77,22.1 80.77,13.97
  pour Top (isolate 0.406, no thermals): 42.55,30.35 40.64,32.26 40.64,51.56 58.42,51.56 58.42,30.35
HOLE_UL  (via drill 3.2 pad 5.5)
  other vias: 37,49.5
HOLE_UM  (via drill 3.2 pad 5.5)
  other vias: 120,49.5
HOLE_UR  (via drill 3.2 pad 5.5)
  other vias: 211.5,5.5
LDO_FB  (via drill 0.4)
  Top 0.254: 53.59,43.94 IC1.5 | R5.2 58.1,46.67 R9.1 55.5,44.07 IC1.5 | 49.4,28.64 R8.1 49.59,28.51 v50.61,29.53 | v53.21,44.7 53.21,44.51 IC1.5
  Bottom 0.254: v53.21,44.7 53.21,32.13 v50.61,29.53
N$1
  Top 0.61: R2.2 R1.1
N$2
  Top 0.254: IC2.7 59.88,21.65 59.63,21.91 59.63,23.56 R13.1 60.05,24.16 C18.1
N$3
  Top 0.254: IC2.12 54.93,20.38 54.61,20.07 54.61,18.35 53.91,17.65 R16.1
N$4
  Top 0.254: R14.1 JP4.COM
N$5
  Bottom 0.61: C2.1 174.24,23.88 174.24,22.42 | 169.46,23.94 170.37,23.03 170.37,22.42
  Bottom 2.032: L2.1A 168.28,24.95 L2.1B 169.67,24.56 169.67,24.15 | L2.1 169.67,24.15 | 169.67,24.15 169.46,23.94 | 170.37,22.42 174.24,22.42 174.37,22.42 179.83,16.95 L1.2
N$6
  Top 0.254: SAR1.1 194.92,32.33 194.48,32.77
  Top 1.676: VAR3.2 VAR1.1 194.49,35.31 194.48,32.77 194.48,32.53
N$7
  Bottom 1.93: 163.71,38.86 172.28,38.86 174.62,41.21 NTC1.2
  Bottom 2.54: K1.11A 163.71,38.86 K1.11B
N$8  (via drill 0.4)
  Top 0.254: v76.33,28.77 76.33,29.05 76.38,29.1
  Top 0.61: C10.1 75.19,29.91 v76.33,28.77 | 78.69,29.08 82.48,29.08 D4.C
  Top 1.524: 78.69,29.08 L4.1 76.38,29.1
  Bottom 0.254: v76.33,29.46 v76.33,28.77 75.95,29.15 75.88,29.15
  Bottom 1.524: TR2.V+ 73.95,31.07 75.88,29.15
N$9
  Top 0.254: R8.2 C16.1 47.43,26.47 JP4.NC
N$10
  Top 0.254: OK1.2 120.08,37.78 121,36.86 D6.A 121.73,35.46 R19.2
N$11  (via drill 0.4)
  Top 0.254: D3.C v139.7,52.64 | v139.7,49.09 ZD1.C
  Top 0.406: ZD1.C D2.C
  Bottom 0.254: v139.7,52.64 v139.7,49.09
N$12
  Top 0.254: Q2.B R4.1
N$13
  Top 0.305: Q3.3 44.7,17.46 R6.2
N$14  (via drill 0.4)
  Top 0.254: LED1.C 7,25.73 10.41,29.15 10.41,51.24 16.14,56.97 40.37,56.97 v40.64,56.71 | R6.1 45.02,20 v44.07,20.95
  Bottom 0.254: v40.64,56.71 40.64,32.26 43.81,29.08 43.81,21.21 v44.07,20.95
N$15  (1 unrouted)
  Top 0.61: D1.C 86.56,20.46 86.05,20.46
  Top 1.524: 90.68,20.19 95.99,20.19 TR1.V+ | 90.68,20.19 86.82,20.19 | 86.05,20.46 80.86,25.65 C7.1 72.72,25.65 L3.1 | TR1.V+1 90.89,19.98 90.68,20.19
N$16  (via drill 0.4)
  Top 0.254: v80.45,32.13 69.98,32.13 68.64,30.8 v62.67,30.8 | v138.37,40.58 138.78,40.58 D2.A 143.55,37.65 K1.A1 | Q2.C 62.78,34.42 v63.31,34.42
  Bottom 0.254: v138.37,40.58 138.24,40.7 127.13,40.7 119.19,32.77 81.28,32.77 80.64,32.13 v80.45,32.13 | v63.31,34.42 62.67,33.78 v62.67,30.8
N$17
  Top 0.254: Q1.B 67.88,38.61 R3.1
N$18
  Top 0.254: IC2.11 54.8,21.02 R15.1
N$19  (via drill 0.4)
  Top 0.254: R18.2 68.77,48.07 | R18.2 68.58,49.28 X3.2 | v79.44,49.72 70.23,49.72 R18.2 | 118.68,45.28 118.75,45.21 118.75,44.61 | 118.75,44.61 OK1.4 | 118.75,44.61 118.27,44.61 v118.24,44.64
  Bottom 0.254: v118.24,44.64 118.24,45.02 113.98,49.28 79.88,49.28 v79.44,49.72
N$20
  Top 0.254: R19.1 126.43,34.04 C20.2
N$21
  Top 0.254: C19.1 56.07,25.69 R17.1 56.12,24.08 IC2.9
N$23
  Top 0.254: IC2.3 62.42,19.11 63.31,18.22 JP3.COM
NFAULT  (via drill 0.4)
  Top 0.254: IC2.13 57.09,19.75 57.59,20.26 57.59,31.11 v58.61,32.13
  Bottom 0.254: X3.15 47.75,54.86 47.75,53.09 51.63,49.21 52.83,49.21 58.29,43.75 58.29,32.45 v58.61,32.13
PE  (via drill 3.2 pad 5.5)  (6 unrouted)
  Top 0.254: SAR1.2 195.01,28.07 195.2,27.88
  Top 0.61: 157.8,1.97 157.92,2.1 157.92,12 153.16,16.76 147.96,16.76 C1.2 C6.1
  Top 1.016: X3.1 64.26,57.4 62.99,58.67 8.77,58.67 SW1.PE2 | 39.24,55.88 17.34,55.88 12.19,50.74 12.19,21.97 17.65,16.51 25.53,16.51
  Top 2.032: J4.1 25.5,6.76 30.29,1.97 157.8,1.97 180.97,1.97 184.98,5.97 184.98,21.02 191.83,27.88 195.2,27.88 208.88,27.88 J1.PE 211,44.13 | X1.6 X1.3 193.75,44.13 200.53,44.13 | 200.53,44.13 211,44.13 | 211,44.13 211,56.02 J3.1 | X2.3 200.6,44.2 200.53,44.13
  Bottom 1.524: J4.1 17.6,16.5 10.54,23.56 10.54,30.56 SW1.PE1 SW1.PE2
  Bottom 2.032: J2.1 J2.2 J3.2 J3.1
  other vias: 15,5.5
PWM_OUT  (via drill 0.4)
  Top 0.254: IC2.6 59.75,21.02 59.12,21.65 59.12,29.21 61.15,31.24 v61.59,31.24 | R12.1 R14.2 50.42,24.57 51.37,25.53 51.37,28.64 52.9,30.16 54.61,30.16 57.91,33.47 61.59,33.47 | X4.4 X5.4 | v80.45,35.43 79.5,35.43 78.87,34.8 69.09,34.8 67.75,33.47 61.59,33.47 | v61.59,33.15 61.59,33.47
  Bottom 0.254: v80.45,35.43 80.71,35.43 81.34,34.8 118.63,34.8 126.3,42.47 126.3,46.1 X5.4 | v61.59,31.24 v61.59,33.15
PWR_DIR_OUT  (via drill 0.4)
  Top 0.254: Q3.1 48.26,13.91 v48.39,13.78 48.39,16.39 R7.2 | v138.37,41.78 138.37,54.77 D3.A 140.21,56.61 K2.A2 | v79.76,32.96 79.44,33.27 69.66,33.27 68.01,31.62 v66.36,31.62 | v66.36,30.04 66.36,14.29 v65.66,13.59 | v67.75,34.54 67.1,34.54 Q1.C
  Bottom 0.254: v48.39,13.78 48.9,13.27 65.34,13.27 v65.66,13.59 | v138.37,41.78 137.79,41.21 126.99,41.21 119.05,33.27 81.09,33.27 80.77,32.96 v79.76,32.96 | v67.75,34.54 67.75,33.02 v66.36,31.62 v66.36,30.04
PWR_DIRECT  (via drill 0.4)
  Top 0.254: R3.2 65.6,38.8 v65.22,38.42
  Bottom 0.254: X3.12 51.56,52.58 53.4,50.74 53.53,50.74 59.82,44.45 59.82,38.86 60.26,38.42 v65.22,38.42
PWR_SSTART  (via drill 0.4)
  Top 0.254: R4.2 61.15,39.18 v60.64,39.18
  Bottom 0.254: X3.11 52.83,54.86 52.83,52.2 60.33,44.7 60.33,39.5 v60.64,39.18
SSCL  (via drill 0.4)
  Top 0.254: IC2.15 57.34,18.48 58.61,19.75 58.61,29.46 60.26,31.11 v60.26,32.19
  Bottom 0.254: 48.9,56.13 X3.13 50.29,54.86 50.29,53.02 53.09,50.23 53.34,50.23 59.31,44.26 59.31,33.34 60.26,32.38 v60.26,32.19
SSDA  (via drill 0.4)
  Top 0.254: IC2.14 57.21,19.11 58.1,20 58.1,30.1 v59.44,31.43
  Bottom 0.254: X3.14 49.02,53.02 52.32,49.72 53.09,49.72 58.8,44.01 58.8,33.08 59.44,32.45 v59.44,31.43

### Text on the board
Bottom: EEZ DIB AUX PS (12/2020 r3B5)
tPlace: CAUTION! | HIGH / VOLTAGE | EEZ DIB AUX PS / (12/2020 r3B5) / Project source code: github.com/eez-open/modular-psu